# Altium schematic sheet MCU.SchDoc: MCU - Group 12
size A3; DrawnBy: William Johanson, Flynn Hill; Address1: ECE Department; Address2: University of Canterbury; Address3: Christchurch 8041; Address4: New Zealand; Revision: 1
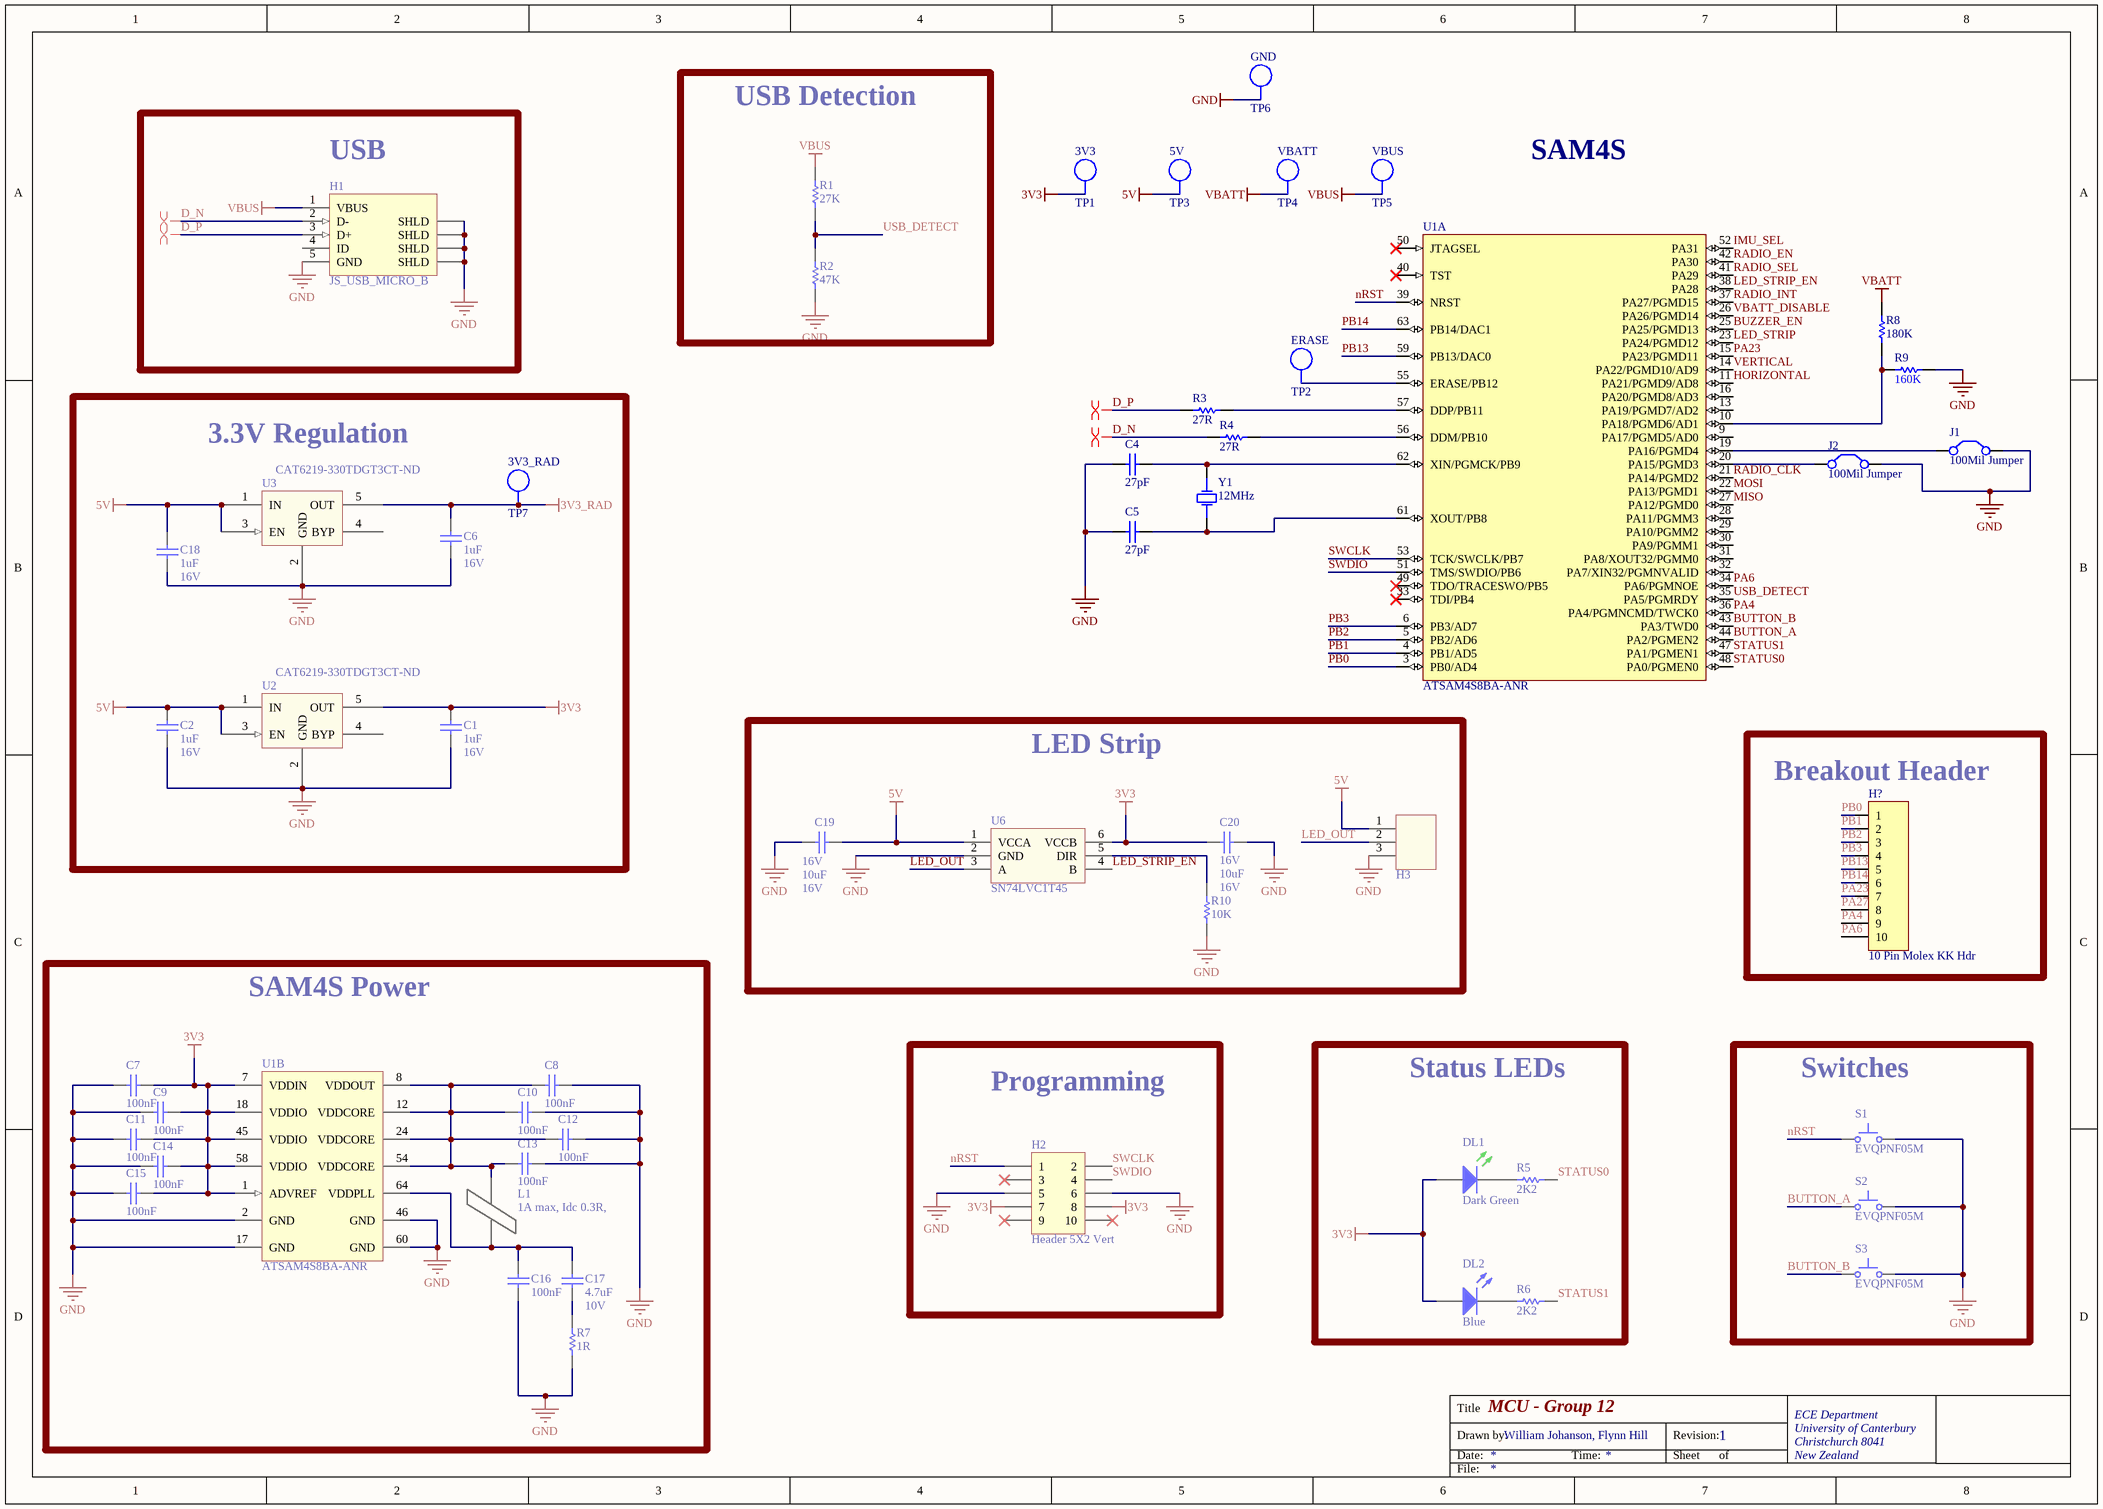
[diagram p0: MCU.SchDoc]

## Parts
C1  Max Voltage: 16V  [CAPC1608L]  (hidden comment: 1uF)
C2  Max Voltage: 16V  [CAPC1608L]  (hidden comment: 1uF)
C4  27pF  [CAPC1608L]
C5  27pF  [CAPC1608L]
C6  Max Voltage: 16V  [CAPC1608L]  (hidden comment: 1uF)
C7  100nF  [CAPC1608L]
C8  100nF  [CAPC1608L]
C9  100nF  [CAPC1608L]
C10  100nF  [CAPC1608L]
C11  100nF  [CAPC1608L]
C12  100nF  [CAPC1608L]
C13  100nF  [CAPC1608L]
C14  100nF  [CAPC1608L]
C15  100nF  [CAPC1608L]
C16  100nF  [CAPC1608L]
C17  Max Voltage: 10V  [CAPC1608N]  (hidden comment: 4.7uF)
C18  Max Voltage: 16V  [CAPC1608L]  (hidden comment: 1uF)
C19  Voltage - Rated: 16V  [CAPC2012L]  (hidden comment: 10uF)
C20  Voltage - Rated: 16V  [CAPC2012L]  (hidden comment: 10uF)
DL1  Dark Green  [WL-SMCW0603]
DL2  Blue  [WL-SMCW0603]
H1  JS_USB_MICRO_B  [FCI_USB_10118194-0001LF]
H2  Header 5X2 Vert  [IDC2.54-V10D]
H3  HEADER_3  [HEADER_3POS]  (value not drawn)
H?  10 Pin Molex KK Hdr  [MOLEX_KK_10_HDR]
J1  100Mil Jumper  [JMP2.54]
J2  100Mil Jumper  [JMP2.54]
L1  1A max, Idc 0.3R,  [INDC3216L]
R1  27K  [RESC1608L]
R2  47K  [RESC1608N]
R3  27R  [RESC3216L]
R4  27R  [RESC3216L]
R5  2K2  [RESC1608L]
R6  2K2  [RESC1608L]
R7  1R  [RESC3216L]
R8  value 180K  [RESC1608L]
R9  160K  [RESC1608L]
R10  10K  [RESC1608L]
S1  EVQPNF05M  [EVQPNF05M]
S2  EVQPNF05M  [EVQPNF05M]
S3  EVQPNF05M  [EVQPNF05M]
TP1  3V3  [TP_1206]  (no BOM)
TP2  ERASE  [TP_1206]  (no BOM)
TP3  5V  [TP_1206]  (no BOM)
TP4  VBATT  [TP_1206]  (no BOM)
TP5  VBUS  [TP_1206]  (no BOM)
TP6  GND  [TP_1206]  (no BOM)
TP7  3V3_RAD  [TP_1206]  (no BOM)
U1  ATSAM4S8BA-ANR  [LQFP64_L]  (parts A,B of 2)
U2  Supplier Part Number: CAT6219-330TDGT3CT-ND  [SOT95P280X145-5N]  (hidden comment: CAT6219-330TDGT3)
U3  Supplier Part Number: CAT6219-330TDGT3CT-ND  [SOT95P280X145-5N]  (hidden comment: CAT6219-330TDGT3)
U6  SN74LVC1T45  [SOT23-6_N]
Y1  12MHz  [6.0X3.5-4]

## Blocks framed on the sheet
USB: H1
USB Detection: R1 R2
3.3V Regulation: C1 C2 C6 C18 TP7 U2 U3
LED Strip: C19 C20 H3 R10 U6
Breakout Header: H?
SAM4S Power: C7-C17 L1 R7 U1
Programming: H2
Status LEDs: DL1 DL2 R5 R6
Switches: S1-S3

## Nets
3V3: C1.2 C7.2 C9.2 C11.2 C14.2 C15.2 C20.1 DL1.2(A) DL2.2(A) H2.7 H2.8 TP1.1 U1.1(ADVREF) U1.7(VDDIN) U1.18(VDDIO) U1.45(VDDIO) U1.58(VDDIO) U2.5(OUT) U6.6(VCCB)
3V3_RAD: C6.2 TP7.1 U3.5(OUT)
5V: C2.2 C18.2 C19.2 H3.1 TP3.1 U2.1(IN) U2.3(EN) U3.1(IN) U3.3(EN) U6.1(VCCA)
GND: C1.1 C2.1 C4.1 C5.1 C6.1 C7.1 C8.2 C9.1 C10.2 C11.1 C12.2 C13.2 C14.1 C15.1 C16.1 C18.1 C19.1 C20.2 H1.5(GND) H1.6(SHLD) H2.5 H2.6 H3.3 J1.2(C2) J2.2(C2) R2.1 R7.1 R9.2 R10.1 S1.2 S2.2 S3.2 TP6.1 U1.2(GND) U1.17(GND) U1.46(GND) U1.60(GND) U2.2(GND) U3.2(GND) U6.2(GND)
VBATT: R8.2 TP4.1
VBUS: H1.1(VBUS) R1.2 TP5.1
BUTTON_A: S2.1 U1.44(PA2/PGMEN2)
BUTTON_B: S3.1 U1.43(PA3/TWD0)
BUZZER_EN: U1.25(PA25/PGMD13)
D_N: H1.2(D-) R4.1
D_P: H1.3(D+) R3.1
HORIZONTAL: U1.11(PA21/PGMD9/AD8)
IMU_SEL: U1.52(PA31)
LED_OUT: H3.2 U6.3(A)
LED_STRIP: U1.23(PA24/PGMD12)
LED_STRIP_EN: U1.38(PA28) U6.4(B)
MISO: U1.27(PA12/PGMD0)
MOSI: U1.22(PA13/PGMD1)
nRST: H2.1 S1.1 U1.39(NRST)
PA4: H?.9 U1.36(PA4/PGMNCMD/TWCK0)
PA6: H?.10 U1.34(PA6/PGMNOE)
PA23: H?.7 U1.15(PA23/PGMD11)
PA27: H?.8
PB0: H?.1 U1.3(PB0/AD4)
PB1: H?.2 U1.4(PB1/AD5)
PB2: H?.3 U1.5(PB2/AD6)
PB3: H?.4 U1.6(PB3/AD7)
PB13: H?.5 U1.59(PB13/DAC0)
PB14: H?.6 U1.63(PB14/DAC1)
RADIO_CLK: U1.21(PA14/PGMD2)
RADIO_EN: U1.42(PA30)
RADIO_INT: U1.37(PA27/PGMD15)
RADIO_SEL: U1.41(PA29)
STATUS0: R5.2 U1.48(PA0/PGMEN0)
STATUS1: R6.2 U1.47(PA1/PGMEN1)
SWCLK: H2.2 U1.53(TCK/SWCLK/PB7)
SWDIO: H2.4 U1.51(TMS/SWDIO/PB6)
USB_DETECT: R1.1 R2.2 U1.35(PA5/PGMRDY)
VBATT_DISABLE: U1.26(PA26/PGMD14)
VERTICAL: U1.14(PA22/PGMD10/AD9)
NetC4_2: C4.2 U1.62(XIN/PGMCK/PB9) Y1.3(OSC2)
NetC5_2: C5.2 U1.61(XOUT/PB8) Y1.1(OSC1)
NetC8_1: C8.1 C10.1 C12.1 C13.1 L1.2 U1.8(VDDOUT) U1.12(VDDCORE) U1.24(VDDCORE) U1.54(VDDCORE)
NetC16_2: C16.2 C17.2 L1.1 U1.64(VDDPLL)
NetC17_1: C17.1 R7.2
NetDL1_1: DL1.1(K) R5.1
NetDL2_1: DL2.1(K) R6.1
NetJ1_1: J1.1(C1) U1.19(PA16/PGMD4)
NetJ2_1: J2.1(C1) U1.20(PA15/PGMD3)
NetR3_2: R3.2 U1.57(DDP/PB11)
NetR4_2: R4.2 U1.56(DDM/PB10)
NetR8_1: R8.1 R9.1 U1.10(PA18/PGMD6/AD1)
NetR10_2: R10.2 U6.5(DIR)
NetTP2_1: TP2.1 U1.55(ERASE/PB12)

Not connected (* = marked no-connect by the designer): H1 4(ID); H2 3* 9* 10*; U1 9(PA17/PGMD5/AD0) 13(PA19/PGMD7/AD2) 16(PA20/PGMD8/AD3) 28(PA11/PGMM3) 29(PA10/PGMM2) 30(PA9/PGMM1) 31(PA8/XOUT32/PGMM0) 32(PA7/XIN32/PGMNVALID) 33(TDI/PB4)* 40(TST)* 49(TDO/TRACESWO/PB5)* 50(JTAGSEL)*; U2 4(BYP); U3 4(BYP)

## Layout directives
differential pair: D_N, D_P

## Notes on the sheet
- SAM4S
- Title
- Drawn by:
- Date:
- Time:
- Revision:
- Sheet
- of
- File:

## Library data of the parts
C1 C2 C6 C18 = CC_1uF_0603: CAP CER 1uF Y5V -20% +80% 16V 0603; PackageReference: 0603; Code_IPC: 1608 [0603]; Verify: *; Supplier: ECE Dept; Storage Location: PCB Assembly WS; Value: 1uF
C4 C5 = CC_27pF_0603: CAP CER 27pF NPO/COG +-5% 50V 0603; PackageReference: 0603; Code_IPC: 1608 [0603]; Verify: *; Supplier: ECE Dept; Storage Location: PCB Assembly WS; Value: 27pF
C7-C16 = CC_100nF_0603: CAP CER 100nF X7R +-10% 50V 0603; PackageReference: 0603; Code_IPC: 1608 [0603]; Verify: *; Supplier: ECE Dept; Storage Location: PCB Assembly WS; Value: 100nF
C17 = CC_4.7uF_0603: CAP CER 4.7uF X5R +-20%  10V 0603; Note: Footprint corresponds to dimensions for bulk cassette packaging. This case size has tightened tolerances.; PackageReference: 0805; Code_IPC: 2012[0805]; Verify: *; Supplier: ECE Dept; Storage Location: PCB Assembly WS; Value: 4.7uF
C19 C20 = CC_10uF_16V_0805: CAP CER 10uF X5R 16V 0805; Manufacturer: Samsung Electro-Mechanics; Manufacturer Part Number: CL21A106KOQNNWE; Note: Footprint corresponds to dimensions for bulk cassette packaging. This case size has tightened tolerances.; Tolerance: ±10%; Notification: Current market demand for these product types have resulted in fluctuating and extending lead times. Lead times may differ.; PackageReference: 0805; Code_IPC: 2012[0805]; Supplier 1: Digi-Key; RoHS: RoHS Compliant; Category: Capacitors; Stock 1: 20000; Pricing 1: 1=0.35, 10=0.25, 100=0.1178, 500=0.08254, 1000=0.06831 (NZD); Packaging: Cut Tape (CT); Part Status: Active; Temperature Coefficient: X5R; Operating Temperature: -55°C ~ 85°C; Features: -; Ratings: -; Applications: General Purpose; Mounting Type: Surface Mount, MLCC; Package / Case: 0805 (2012 Metric); Size / Dimension: 0.079" L x 0.049" W (2.00mm x 1.25mm); Height - Seated (Max): -; Thickness (Max): 0.055" (1.40mm); Lead Spacing: -; Lead Style: -; ComponentLink1URL: http://www.samsungsem.com/kr/support/product-search/mlcc/CL21A106KOQNNWE.jsp; ComponentLink1Description: http://www.samsungsem.com/kr/support/product-search/mlcc/CL21A106KOQNNWE.jsp; Supplier Part Number 1: 1276-2894-1-ND; Value: 10uF; Max Voltage: 16V
DL1 = DL_150060GS75000: LED Dk Green 430mcd 0603 SMD; Manufacturer: WURTH ELEKTRONIK; Forward Current If: 30; Wavelength Typ: 520; Forward Voltage: 3.2; Lens Shape: Rectangular; Luminous Intensity: 430; Viewing Angle: 140°; LED Mounting: SMD; Supplier 1: Farnell; Supplier Part Number 1: 2322070; Manufacturer Part Number: 150060GS75000; Storage Location: PCB Assembly WS; Supplier: ECE Dept; LED Colour: Dark Green
DL2 = DL_150060BS75000: LED Blue 270mcd 0603 SMD; Manufacturer: WURTH ELEKTRONIK; Forward Current If: 30; Forward Voltage: 3.2; Luminous Intensity: 270; Viewing Angle: 120°; Wavelength Typ: 470; Pricing: 1=0.3844, 50=0.3252, 100=0.2957, 500=0.2365 (NZD); Supplier 1: Farnell; Supplier Part Number 1: 2322069; Manufacturer Part Number: 150060BS75000; Storage Location: PCB Assembly WS; Supplier: ECE Dept; LED Colour: Blue
H1 = JS_USB_MICRO_B_SMT: CONN USB MICRO B RECPT SMT R/A; Manufacturer: FCI; Manufacturer Part Number: 10118194-0001LF; Gender: Receptacle; Number of Contacts: 5; Specifications: USB 2.0; Supplier 1: Digi-Key; Supplier Part Number 1: 609-4618-1-ND; Features: Shielded, Solder Retention; Mounting Type: Surface Mount, Right Angle, Horizontal
H2 = JA_HDR_IDC_5X2_VERT: IDC Header, 2,54mm, 10-Pin, Vert; Supplier: ECE Dept; Supplier 1: Farnell; Supplier Part Number 1: 1096985; Storage Location: ECE Dept Store
H3 = HEADER_3: 3Pin Header 2.54mm spacing
H? = JA_MOLEX_KK_10POS: CONN HEADER 10POS 2.54mm VERT_ Thru Hole; Supplier 1: Farnell; Supplier Part Number 1: 1756828; Supplier: ECE Dept; Storage Location: ECE Dept Store; Value: 10 Pin Molex KK Hdr
J1 J2 = TP_JUMPER: 2.54mm Jumper Thru Hole; Pitch Spacing: 2.54; No. of Rows: 1; No. of Positions: 2; Supplier: ECE Dept; Supplier 1: Farnell; Supplier Part Number 1: 1097975; Storage Location: ECE$ Store
L1 = IN_Ferrite-Bead: Ferrite Bead, Rdc 0.3R, Z100MHZ 600R, Imax 1A, SMD 1206; Manufacturer: FAIR-RITE; Manufacturer PN: 2512066017Y1; DC Current Rating: 1; DC Resistance Max: 0.08; Ferrite Case Style: 1206 ^3216 Metric]; Frequency Range: 50MHz to 1; Impedance: 600; Impedance Tolerance: ± 25%; Supplier: ECE Dept; Storage Location: PCB Assembly WS; Ferrite Mounting: SMD; Supplier 1: Farnell; Supplier Part Number 1: 1612060; Manufacturer Part Number: 2512066017Y1; Value: 1A max, Idc 0.3R,
R1 = RS_27K: RES 27K OHM 1/10W 5% 0603 SMD; Storage Location: PCB Assembly WS; Supplier: ECE Dept; Value: 27K
R2 = RS_47K: RES 47.0K OHM 1/10W 5% 0603 SMD; Storage Location: PCB Assembly WS; Supplier: ECE Dept; Value: 47K
R3 R4 = RT_27R: RES 27R OHM 1/4W 5% 1206 SMD; Storage Location: PCB Assembly WS; Supplier: ECE Dept; Value: 27R
R5 R6 = RS_2K2: RES 2.2K OHM 1/10W 5% 0603 SMD; Storage Location: PCB Assembly WS; Supplier: ECE Dept; Value: 2K2
R7 = RT_1R: RES 1R OHM 1/4W 5% 1206 SMD; Storage Location: PCB Assembly WS; Supplier: ECE Dept; Value: 1R
R8 = RS_180K: RES 180K OHM 1/10W 5% 0603 SMD; Storage Location: PCB Assembly WS; Supplier: ECE Dept
R9 = RS_160K: RES 160K OHM 1/10W 5% 0603 SMD; Storage Location: PCB Assembly WS; Supplier: ECE Dept; Value: 160K
R10 = RS_10K: RES 10.0K OHM 1/10W 5% 0603 SMD; Storage Location: PCB Assembly WS; Supplier: ECE Dept; Value: 10K
S1-S3 = WS_EVQPNF05M: Panasonic 6 x 3.5mm SMD Light Touch Switch Type SMD; PackageDescription: 6.0 x 3.5 mm; Supplier 1: Farnell; Supplier Part Number 1: 2079481; Manufacturer: Panasonic; Manufacturer PN: EVQPNF05M; Supplier 2: Digi-Key; Supplier Part Number 2: P13598SCT-ND; Storage Location: PCB Assembly WS; Supplier: ECE Dept
TP1-TP7 = TP_1206: Test-Point 3.3x1.6x2.1mm SMD; Manufacturer: Harwin Inc; Manufacturer Part Number: S1751-46R; Value: TP; Manufacturer PN: *; Storage Location: ProtoPlace; Mounting Type: Surface Mount; Type: PC Test Point; Supplier 1: Digi-Key; Supplier Part Number 1: 952-1478-2-ND; Supplier 2: Farnell; Supplier Part Number 2: 1826282; Supplier: ECE Dept
U1 = SE_ATSAM4S16BA-MU: IC MCU 32BIT 512KB FLASH 64LQFP; Manufacturer: Atmel; Connectivity: I²C, IrDA, Memory Card, SPI, SSC, UART/USART, USB; Core Processor: ARM® Cortex®-M4; Core Size: 32-Bit; Data Converters: A/D 11x12b, D/A 2x12b; Number of I/O: 47; Peripherals: Brown-out Detect/Reset, DMA, POR, PWM, WDT; Program Memory Size: 512KB (512K x 8); RAM Size: 128K x 8; Speed: 120MHz; Voltage - Supply (Vcc/Vdd): 1.62 V ~ 3.6 V; PackageVersion: revJ, Jul-2007; PackageReference: 64PS; PackageDescription: 64-Pin Quad Flat No-Lead (QFN) Sawn, 9 x 9 x 1.0 mm Body, 0.5 mm Pitch, Exposed Pad; Code_JEDEC: MO-220VMMD-3; ComponentLink1Description: Manufacturer URL; ComponentLink1URL: http://www.atmel.com/; ComponentLink2Description: SAM4S Series Datasheet; ComponentLink2URL: http://www.atmel.com/dyn/resources/prod_documents/11100.pdf; ComponentLink3Description: SAM4S Series Summary; ComponentLink3URL: http://www.atmel.com/dyn/resources/prod_documents/11100S.pdf; Supplier 1: Digi-Key; Package / Case: 64-LQFP; Packaging: Cut Tape (CT); Program Memory Type: FLASH; Supplier Part Number 1: ATSAM4S8BA-ANRCT-ND; Manufacturer Part Number: ATSAM4S8BA-ANR
U2 U3 = SV_CAT6219-330TDGT3: IC REG LIN 3.3V 500MA TSOT23-5; Voltage - Input (Max): 5.5V; Voltage Dropout (Max): 0.5V @ 500mA; Manufacturer Part Number: CAT6219-330TDGT3; Base Part Number: CAT6219; Current - Output: 500mA; Package / Case: SOT-23-5 Thin, TSOT-23-5; Supplier: Digi-Key; Supplier Device Package: TSOT-23-5; Voltage - Output (Min/Fixed): 3.3V; ComponentLink1URL: http://www.onsemi.com/pub/Collateral/CAT6219-D.PDF; ComponentLink1Description: http://www.onsemi.com/pub/Collateral/CAT6219-D.PDF; Supplier 1: Digi-Key
U6 = SN74LVC1T45: 1.8V - 5V level converter
Y1 = XT_CRYSTAL_12MHz_18pF: CRYSTAL 12MHZ 18PF 6X3.5mm SMD; Manufacturer: CTS-Frequency Controls; Manufacturer Part Number: 406C35D12M00000; ESR (Equivalent Series Resistance): 60 Ohm; Frequency Stability: ±50ppm; Frequency Tolerance: ±30ppm; Operating Mode: Fundamental; Supplier 1: Digi-Key; Height: 0.047" (1.20mm); Load Capacitance: 18pF; Mounting Type: Surface Mount; Operating Temperature: -20°C ~ 70°C; Package / Case: 4-SMD, No Lead (DFN, LCC); Size / Dimension: 0.236" L x 0.138" W (6.00mm x 3.50mm); Supplier Part Number 1: CTX855CT-ND; Frequency: 12MHz